# Altium schematic sheet Msi2500.SchDoc
size A3
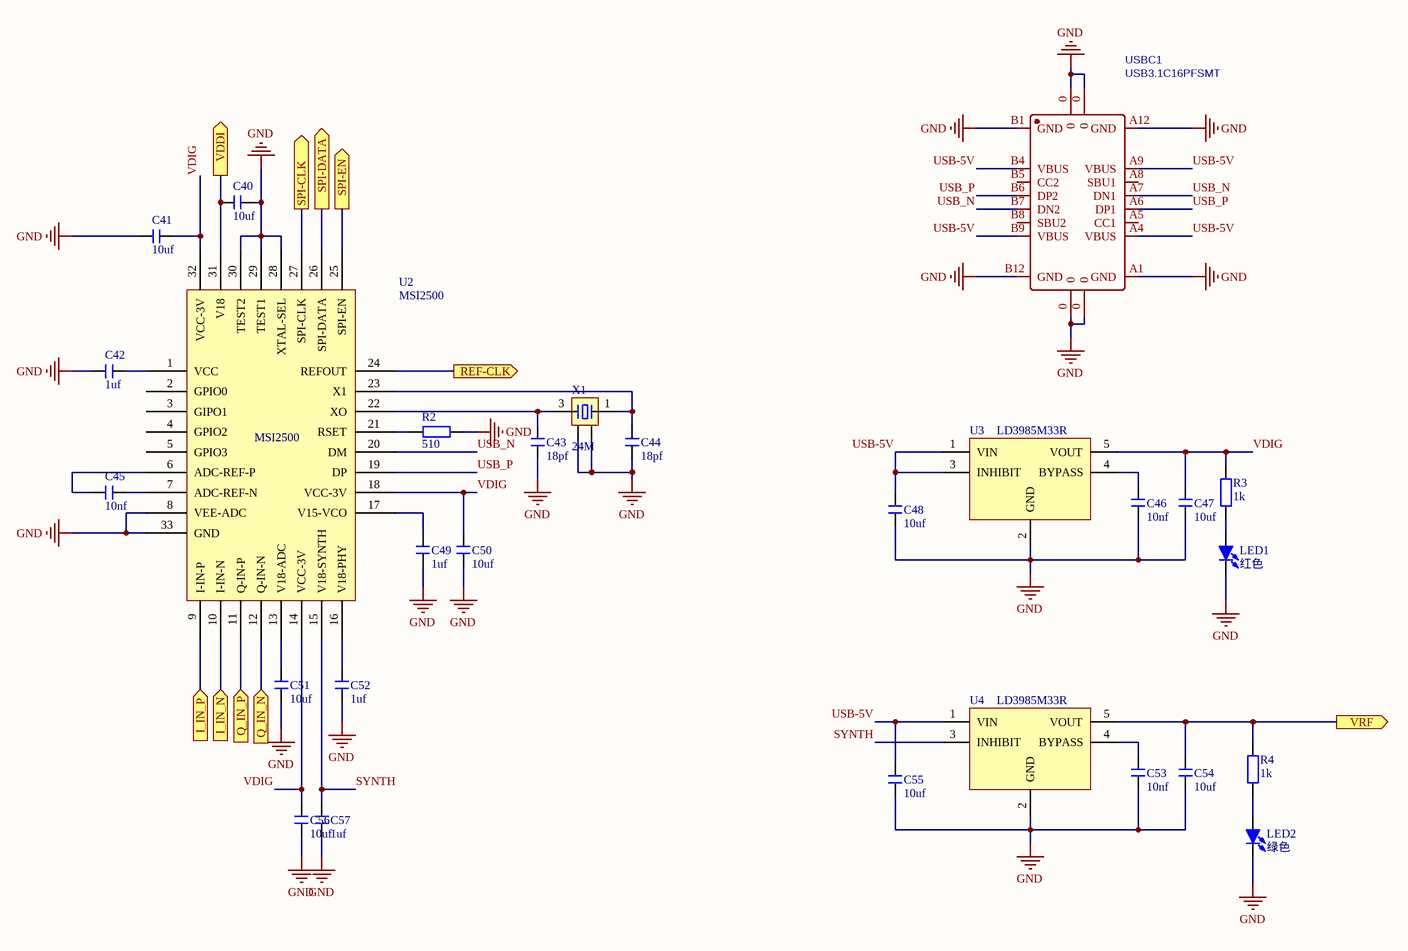
[diagram p0: Msi2500.SchDoc]

## Parts
C40  10uf  [C 0603_M]
C41  10uf  [C 0603_M]
C42  1uf  [C 0603_M]
C43  18pf  [C 0603_M]
C44  18pf  [C 0603_M]
C45  10nf  [C 0603_M]
C46  10nf  [C 0603_M]
C47  10uf  [C 0603_M]
C48  10uf  [C 0603_M]
C49  1uf  [C 0603_M]
C50  10uf  [C 0603_M]
C51  10uf  [C 0603_M]
C52  1uf  [C 0603_M]
C53  10nf  [C 0603_M]
C54  10uf  [C 0603_M]
C55  10uf  [C 0603_M]
C56  10uf  [C 0603_M]
C57  1uf  [C 0603_M]
LED1  红色  [LED 0805G]
LED2  绿色  [LED 0805G]
R2  510  [R 0603_M]
R3  1k  [R 0603_M]
R4  1k  [R 0603_M]
U2  MSI2500  [QFN32 5x5_M]
U3  LD3985M33R  [SOT23-5]
U4  LD3985M33R  [SOT23-5]
USBC1  USB3.1C16PFSMT  [USB-TYPEC-16PIN]
X1  24M  [OSC 3225-4P]

## Ports
I_IN_N (in), I_IN_P (in), Q_IN_N (in), Q_IN_P (in), REF-CLK (out), SPI-CLK (out), SPI-DATA (out), SPI-EN (out), VDDI (out), VRF (out)

## Nets
GND: C40.1 C41.2 C42.1 C43.2 C44.2 C46.1 C47.1 C48.1 C49.2 C50.2 C51.2 C52.2 C53.1 C54.1 C55.1 C56.2 C57.2 LED1.2(K) LED2.2(K) R2.1 U2.8(VEE-ADC) U2.28(XTAL-SEL) U2.29(TEST1) U2.30(TEST2) U2.33(GND) U3.2(GND) U4.2(GND) USBC1.0 USBC1.A1(GND) USBC1.A12(GND) USBC1.B1(GND) USBC1.B12(GND) X1.2 X1.4
I_IN_N: U2.10(I-IN-N) ; port I_IN_N
I_IN_P: U2.9(I-IN-P) ; port I_IN_P
Q_IN_N: U2.12(Q-IN-N) ; port Q_IN_N
Q_IN_P: U2.11(Q-IN-P) ; port Q_IN_P
REF-CLK: U2.24(REFOUT) ; port REF-CLK
SPI-CLK: U2.27(SPI-CLK) ; port SPI-CLK
SPI-DATA: U2.26(SPI-DATA) ; port SPI-DATA
SPI-EN: U2.25(SPI-EN) ; port SPI-EN
SYNTH: C57.1 U2.15(V18-SYNTH) U4.3(INHIBIT)
USB-5V: C48.2 C55.2 U3.1(VIN) U3.3(INHIBIT) U4.1(VIN) USBC1.A4(VBUS) USBC1.A9(VBUS) USBC1.B4(VBUS) USBC1.B9(VBUS)
USB_N: U2.20(DM) USBC1.A7(DN1) USBC1.B7(DN2)
USB_P: U2.19(DP) USBC1.A6(DP1) USBC1.B6(DP2)
VDDI: C40.2 U2.31(V18) ; port VDDI
VDIG: C41.1 C47.2 C50.1 C56.1 R3.1 U2.14(VCC-3V) U2.18(VCC-3V) U2.32(VCC-3V) U3.5(VOUT)
VRF: C54.2 R4.1 U4.5(VOUT) ; port VRF
NetC42_2: C42.2 U2.1(VCC)
NetC43_1: C43.1 U2.22(XO) X1.3
NetC44_1: C44.1 U2.23(X1) X1.1
NetC45_1: C45.1 U2.6(ADC-REF-P)
NetC45_2: C45.2 U2.7(ADC-REF-N)
NetC46_2: C46.2 U3.4(BYPASS)
NetC49_1: C49.1 U2.17(V15-VCO)
NetC51_1: C51.1 U2.13(V18-ADC)
NetC52_1: C52.1 U2.16(V18-PHY)
NetC53_2: C53.2 U4.4(BYPASS)
NetLED1_1: LED1.1(A) R3.2
NetLED2_1: LED2.1(A) R4.2
NetR2_2: R2.2 U2.21(RSET)

Not connected (* = marked no-connect by the designer): U2 2(GPIO0) 3(GIPO1) 4(GPIO2) 5(GPIO3); USBC1 A5(CC1) A8(SBU1) B5(CC2) B8(SBU2)

## Library data of the parts
C40-C57 = C: 无极性贴片电容; 版权归属: 源创客; BOM名称: 无极性贴片电容; 学习资源: www.ooocke.com
LED1 LED2 = LED-SMD: 贴片LED; 版权归属: 源创客; BOM名称: 贴片LED; 学习资源: www.ooocke.com
R2-R4 = R: 贴片电阻; 版权归属: 源创客; BOM名称: 贴片电阻; 学习资源: www.ooocke.com
U3 U4 = LD3985M33R: LDO
USBC1 = USB3.1C16PFSMT: BOM_Manufacturer: LCSC; BOM_Supplier: LCSC; BOM_Supplier Part: C167321; BOM_Manufacturer Part: -; Contributor: LCSC; spicePre: U; spiceSymbolName: USB3.1C16PFSMT
X1 = XTAL-4P: 4脚无源晶振; 版权归属: 源创客; BOM名称: 4脚无源晶振; 学习资源: www.ooocke.com